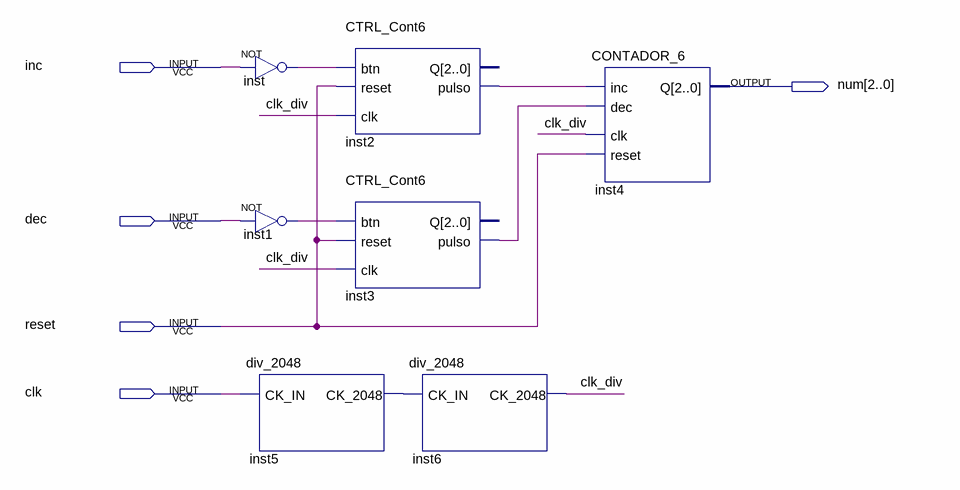
[diagram p0: schematic sheet]
// Quartus schematic CTR_INCDEC.bdf as structural Verilog: 7 symbols, 5 pins
module CTR_INCDEC (
  input  inc,
  input  dec,
  input  reset,
  input  clk,
  output [2:0] num
);

  wire clk_div, inst1_out, inst2_pulso, inst3_pulso, inst5_ck_2048, inst_out;

  not inst (inst_out, inc);
  not inst1 (inst1_out, dec);
  div_2048 inst5 (.CK_IN(clk), .CK_2048(inst5_ck_2048));
  CTRL_Cont6 inst2 (.btn(inst_out), .reset(reset), .clk(clk_div), .pulso(inst2_pulso));  // open: Q
  CTRL_Cont6 inst3 (.btn(inst1_out), .reset(reset), .clk(clk_div), .pulso(inst3_pulso));  // open: Q
  div_2048 inst6 (.CK_IN(inst5_ck_2048), .CK_2048(clk_div));
  CONTADOR_6 inst4 (.inc(inst2_pulso), .dec(inst3_pulso), .clk(clk_div), .reset(reset), .Q(num));
endmodule
